# EAGLE schematic alu (EAGLE 6.5.0)
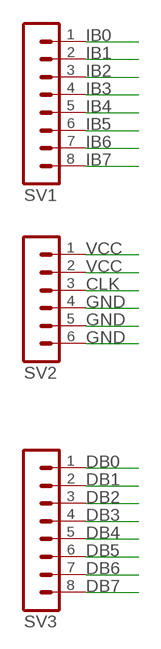
[diagram p0: schematic, sheet 1, part 1 of 2]
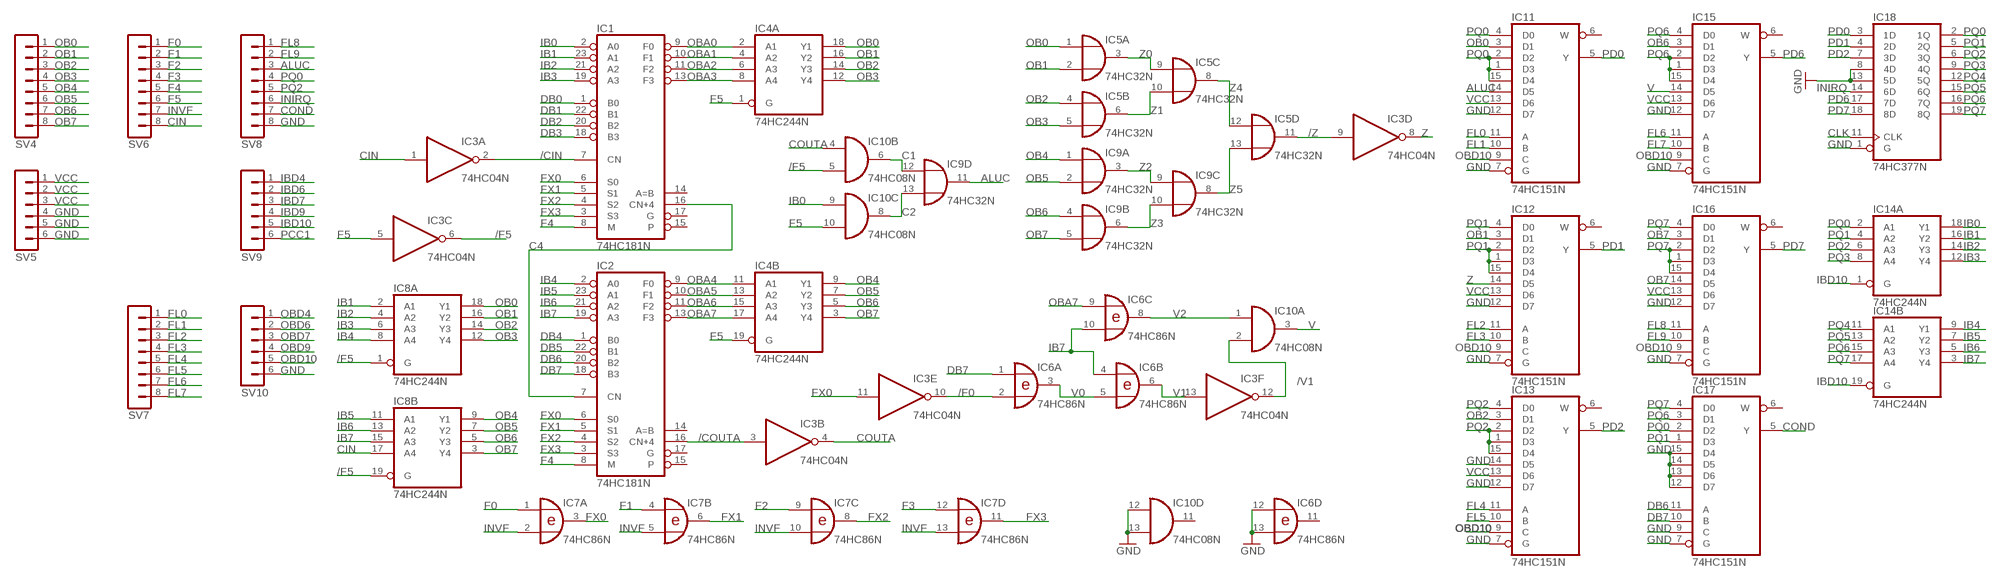
[diagram p1: schematic, sheet 1, part 2 of 2]

## Parts
IC1  74HC181N  [DIL24-6]
IC2  74HC181N  [DIL24-6]
IC3  74HC04N  [DIL14]
IC4  74HC244N  [DIL20]
IC5  74HC32N  [DIL14]
IC6  74HC86N  [DIL14]
IC7  74HC86N  [DIL14]
IC8  74HC244N  [DIL20]
IC9  74HC32N  [DIL14]
IC10  74HC08N  [DIL14]
IC11  74HC151N  [DIL16]
IC12  74HC151N  [DIL16]
IC13  74HC151N  [DIL16]
IC14  74HC244N  [DIL20]
IC15  74HC151N  [DIL16]
IC16  74HC151N  [DIL16]
IC17  74HC151N  [DIL16]
IC18  74HC377N  [DIL20]
SV1  MA08-1  [MA08-1]
SV2  MA06-1  [MA06-1]
SV3  MA08-1  [MA08-1]
SV4  MA08-1  [MA08-1]
SV5  MA06-1  [MA06-1]
SV6  MA08-1  [MA08-1]
SV7  MA08-1  [MA08-1]
SV8  MA08-1  [MA08-1]
SV9  MA06-1  [MA06-1]
SV10  MA06-1  [MA06-1]

## Nets
/CIN: IC1.7(CN) IC3.2(A:O)
/COUTA: IC2.16(CN+4) IC3.3(B:I)
/F0: IC3.10(E:O) IC6.2(A:I1)
/F5: IC3.6(C:O) IC8.1(A:G) IC8.19(B:G) IC10.5(B:I1)
/V1: IC3.12(F:O) IC10.2(A:I1)
/Z: IC3.9(D:I) IC5.11(D:O)
ALUC: IC9.11(D:O) IC11.14(D5) SV8.3
C1: IC9.12(D:I0) IC10.6(B:O)
C2: IC9.13(D:I1) IC10.8(C:O)
C4: IC1.16(CN+4) IC2.7(CN)
CIN: IC3.1(A:I) IC8.17(B:A4) SV6.8
CLK: IC18.11(CLK) SV2.3
COND: IC17.5(Y) SV8.7
COUTA: IC3.4(B:O) IC10.4(B:I0)
DB0: IC1.1(B0) SV3.1
DB1: IC1.22(B1) SV3.2
DB2: IC1.20(B2) SV3.3
DB3: IC1.18(B3) SV3.4
DB4: IC2.1(B0) SV3.5
DB5: IC2.22(B1) SV3.6
DB6: IC2.20(B2) IC17.11(A) SV3.7
DB7: IC2.18(B3) IC6.1(A:I0) IC17.10(B) SV3.8
F0: IC7.1(A:I0) SV6.1
F1: IC7.4(B:I0) SV6.2
F2: IC7.9(C:I0) SV6.3
F3: IC7.12(D:I0) SV6.4
F4: IC1.8(M) IC2.8(M) SV6.5
F5: IC3.5(C:I) IC4.1(A:G) IC4.19(B:G) IC10.10(C:I1) SV6.6
FL0: IC11.11(A) SV7.1
FL1: IC11.10(B) SV7.2
FL2: IC12.11(A) SV7.3
FL3: IC12.10(B) SV7.4
FL4: IC13.11(A) SV7.5
FL5: IC13.10(B) SV7.6
FL6: IC15.11(A) SV7.7
FL7: IC15.10(B) SV7.8
FL8: IC16.11(A) SV8.1
FL9: IC16.10(B) SV8.2
FX0: IC1.6(S0) IC2.6(S0) IC3.11(E:I) IC7.3(A:O)
FX1: IC1.5(S1) IC2.5(S1) IC7.6(B:O)
FX2: IC1.4(S2) IC2.4(S2) IC7.8(C:O)
FX3: IC1.3(S3) IC2.3(S3) IC7.11(D:O)
GND: IC6.12(D:I0) IC6.13(D:I1) IC10.12(D:I0) IC10.13(D:I1) IC11.7(G) IC11.12(D7) IC12.7(G) IC12.12(D7) IC13.7(G) IC13.12(D7) IC13.14(D5) IC15.7(G) IC15.12(D7) IC16.7(G) IC16.12(D7) IC17.7(G) IC17.9(C) IC17.12(D7) IC17.13(D6) IC17.14(D5) IC17.15(D4) IC18.1(G) IC18.8(4D) IC18.13(5D) SV2.4 SV2.5 SV2.6 SV5.4 SV5.5 SV5.6 SV8.8 SV10.6
IB0: IC1.2(A0) IC10.9(C:I0) IC14.18(A:Y1) SV1.1
IB1: IC1.23(A1) IC8.2(A:A1) IC14.16(A:Y2) SV1.2
IB2: IC1.21(A2) IC8.4(A:A2) IC14.14(A:Y3) SV1.3
IB3: IC1.19(A3) IC8.6(A:A3) IC14.12(A:Y4) SV1.4
IB4: IC2.2(A0) IC8.8(A:A4) IC14.9(B:Y1) SV1.5
IB5: IC2.23(A1) IC8.11(B:A1) IC14.7(B:Y2) SV1.6
IB6: IC2.21(A2) IC8.13(B:A2) IC14.5(B:Y3) SV1.7
IB7: IC2.19(A3) IC6.4(B:I0) IC6.10(C:I1) IC8.15(B:A3) IC14.3(B:Y4) SV1.8
IBD4: SV9.1
IBD6: SV9.2
IBD7: SV9.3
IBD9: SV9.4
IBD10: IC14.1(A:G) IC14.19(B:G) SV9.5
INIRQ: IC18.14(6D) SV8.6
INVF: IC7.2(A:I1) IC7.5(B:I1) IC7.10(C:I1) IC7.13(D:I1) SV6.7
OB0: IC4.18(A:Y1) IC5.1(A:I0) IC8.18(A:Y1) IC11.3(D1) SV4.1
OB1: IC4.16(A:Y2) IC5.2(A:I1) IC8.16(A:Y2) IC12.3(D1) SV4.2
OB2: IC4.14(A:Y3) IC5.4(B:I0) IC8.14(A:Y3) IC13.3(D1) SV4.3
OB3: IC4.12(A:Y4) IC5.5(B:I1) IC8.12(A:Y4) SV4.4
OB4: IC4.9(B:Y1) IC8.9(B:Y1) IC9.1(A:I0) SV4.5
OB5: IC4.7(B:Y2) IC8.7(B:Y2) IC9.2(A:I1) SV4.6
OB6: IC4.5(B:Y3) IC8.5(B:Y3) IC9.4(B:I0) IC15.3(D1) SV4.7
OB7: IC4.3(B:Y4) IC8.3(B:Y4) IC9.5(B:I1) IC16.3(D1) IC16.14(D5) SV4.8
OBA0: IC1.9(F0) IC4.2(A:A1)
OBA1: IC1.10(F1) IC4.4(A:A2)
OBA2: IC1.11(F2) IC4.6(A:A3)
OBA3: IC1.13(F3) IC4.8(A:A4)
OBA4: IC2.9(F0) IC4.11(B:A1)
OBA5: IC2.10(F1) IC4.13(B:A2)
OBA6: IC2.11(F2) IC4.15(B:A3)
OBA7: IC2.13(F3) IC4.17(B:A4) IC6.9(C:I0)
OBD4: SV10.1
OBD6: SV10.2
OBD7: SV10.3
OBD9: SV10.4
OBD10: IC11.9(C) IC12.9(C) IC13.9(C) IC15.9(C) IC16.9(C) SV10.5
PCC1: SV9.6
PD0: IC11.5(Y) IC18.3(1D)
PD1: IC12.5(Y) IC18.4(2D)
PD2: IC13.5(Y) IC18.7(3D)
PD6: IC15.5(Y) IC18.17(7D)
PD7: IC16.5(Y) IC18.18(8D)
PQ0: IC11.1(D3) IC11.2(D2) IC11.4(D0) IC11.15(D4) IC14.2(A:A1) IC17.2(D2) IC18.2(1Q) SV8.4
PQ1: IC12.1(D3) IC12.2(D2) IC12.4(D0) IC12.15(D4) IC14.4(A:A2) IC17.1(D3) IC18.5(2Q)
PQ2: IC13.1(D3) IC13.2(D2) IC13.4(D0) IC13.15(D4) IC14.6(A:A3) IC18.6(3Q) SV8.5
PQ3: IC14.8(A:A4) IC18.9(4Q)
PQ4: IC14.11(B:A1) IC18.12(5Q)
PQ5: IC14.13(B:A2) IC18.15(6Q)
PQ6: IC14.15(B:A3) IC15.1(D3) IC15.2(D2) IC15.4(D0) IC15.15(D4) IC17.3(D1) IC18.16(7Q)
PQ7: IC14.17(B:A4) IC16.1(D3) IC16.2(D2) IC16.4(D0) IC16.15(D4) IC17.4(D0) IC18.19(8Q)
V: IC10.3(A:O) IC15.14(D5)
V0: IC6.3(A:O) IC6.5(B:I1)
V1: IC3.13(F:I) IC6.6(B:O)
V2: IC6.8(C:O) IC10.1(A:I0)
VCC: IC11.13(D6) IC12.13(D6) IC13.13(D6) IC15.13(D6) IC16.13(D6) SV2.1 SV2.2 SV5.1 SV5.2 SV5.3
Z: IC3.8(D:O) IC12.14(D5)
Z0: IC5.3(A:O) IC5.9(C:I0)
Z1: IC5.6(B:O) IC5.10(C:I1)
Z2: IC9.3(A:O) IC9.9(C:I0)
Z3: IC9.6(B:O) IC9.10(C:I1)
Z4: IC5.8(C:O) IC5.12(D:I0)
Z5: IC5.13(D:I1) IC9.8(C:O)
Unconnected: IC1.14(A=B) IC1.15(P) IC1.17(G) IC2.14(A=B) IC2.15(P) IC2.17(G) IC6.11(D:O) IC10.11(D:O) IC11.6(W) IC12.6(W) IC13.6(W) IC15.6(W) IC16.6(W) IC17.6(W)

## Power pins joined to a net without a drawn wire
GND: IC1.12(GND) IC2.12(GND) IC3.7(P:GND) IC4.10(P:GND) IC5.7(P:GND) IC6.7(P:GND) IC7.7(P:GND) IC8.10(P:GND) IC9.7(P:GND) IC10.7(P:GND) IC11.8(GND) IC12.8(GND) IC13.8(GND) IC14.10(P:GND) IC15.8(GND) IC16.8(GND) IC17.8(GND) IC18.10(GND)
VCC: IC1.24(VCC) IC2.24(VCC) IC3.14(P:VCC) IC4.20(P:VCC) IC5.14(P:VCC) IC6.14(P:VCC) IC7.14(P:VCC) IC8.20(P:VCC) IC9.14(P:VCC) IC10.14(P:VCC) IC11.16(VCC) IC12.16(VCC) IC13.16(VCC) IC14.20(P:VCC) IC15.16(VCC) IC16.16(VCC) IC17.16(VCC) IC18.20(VCC)

## Library data of the parts
IC1 IC2 = 74xx-eu:74*181: ARITHMETIC LOGIC UNIT function generator
IC3 = 74xx-eu:74*04: Hex INVERTER
IC4 IC8 IC14 = 74xx-eu:74*244: Octal BUFFER and LINE DRIVER, 3-state
IC5 IC9 = 74xx-eu:74*32: Quad 2-input OR gate
IC6 IC7 = 74xx-eu:74*86: Quad 2-input EXCLUSIVE-OR (XOR) gate
IC10 = 74xx-eu:74*08: Quad 2-input AND gate
IC11-IC13 IC15-IC17 = 74xx-eu:74*151: Data SELECTOR/MULTIPLEXER
IC18 = 74xx-eu:74*377: Octal D type FLIP FLOP, enable
SV1 SV3 SV4 SV6-SV8 = con-lstb:MA08-1: PIN HEADER; OC_FARNELL: unknown; OC_NEWARK: unknown
SV2 SV5 SV9 SV10 = con-lstb:MA06-1: PIN HEADER; OC_FARNELL: unknown; OC_NEWARK: unknown